# Altium project CollisionDetection.PrjPcb
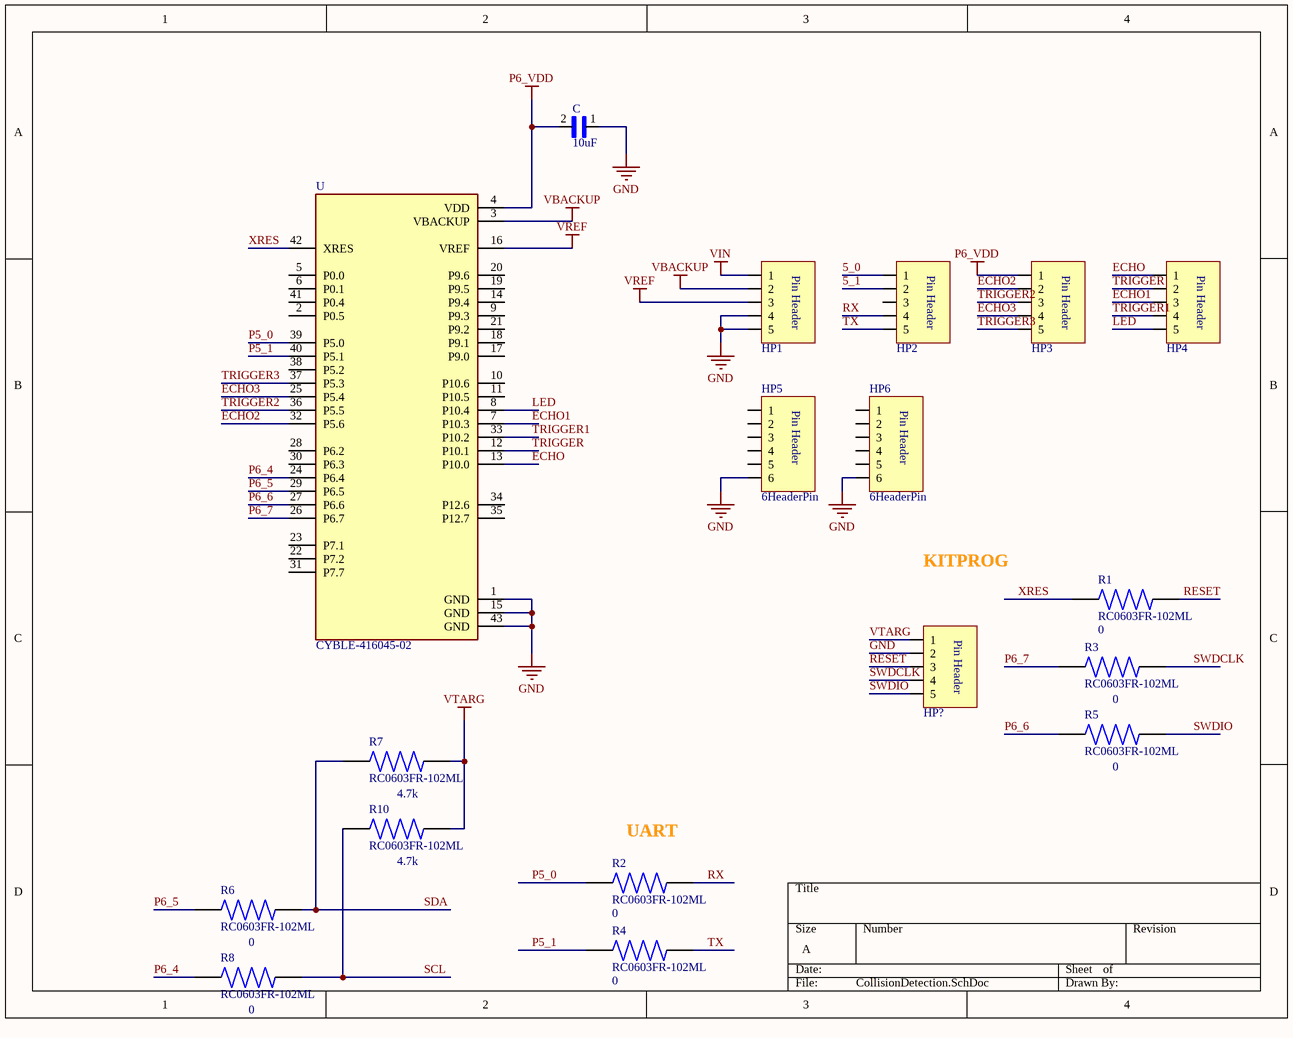
[diagram p0: CollisionDetection.SchDoc]
1 sheet, 18 parts. Net scope: global (net labels, ports and power ports of the same name join across sheets).
Board file: CollisionDetection.PcbDoc

## Sheet CollisionDetection.SchDoc
size A; SheetNumber: 1; SheetTotal: 1

### Parts
C  10uF  [CAPC1608X90]
HP1  5HeaderPin  [5HeaderPin]  (value not drawn)
HP2  5HeaderPin  [5HeaderPin]  (value not drawn)
HP3  5HeaderPin  [5HeaderPin]  (value not drawn)
HP4  5HeaderPin  [5HeaderPin]  (value not drawn)
HP5  6HeaderPin  [6HeaderPin]
HP6  6HeaderPin  [6HeaderPin]
HP?  5HeaderPin  [5HeaderPin]  (value not drawn)
R1  RC0603FR-102ML  value 0  [RESC1608X55N]
R2  RC0603FR-102ML  value 0  [RESC1608X55N]
R3  RC0603FR-102ML  value 0  [RESC1608X55N]
R4  RC0603FR-102ML  value 0  [RESC1608X55N]
R5  RC0603FR-102ML  value 0  [RESC1608X55N]
R6  RC0603FR-102ML  value 0  [RESC1608X55N]
R7  RC0603FR-102ML  value 4.7k  [RESC1608X55N]
R8  RC0603FR-102ML  value 0  [RESC1608X55N]
R10  RC0603FR-102ML  value 4.7k  [RESC1608X55N]
U  CYBLE-416045-02  [XCVR_CYBLE-416045-02]

### Nets
GND: C.1 HP1.4 HP1.5 HP5.6 HP6.6 HP?.2 U.1(GND) U.15(GND) U.43(GND)
P6_VDD: C.2 HP3.1 U.4(VDD)
VBACKUP: HP1.2 U.3(VBACKUP)
VIN: HP1.1
VREF: HP1.3 U.16(VREF)
VTARG: HP?.1 R7.2 R10.2
5_0: HP2.1
5_1: HP2.2
ECHO: HP4.1 U.13(P10.0)
ECHO1: HP4.3 U.7(P10.3)
ECHO2: HP3.2 U.32(P5.6)
ECHO3: HP3.4 U.25(P5.4)
LED: HP4.5 U.8(P10.4)
P5_0: R2.1 U.39(P5.0)
P5_1: R4.1 U.40(P5.1)
P6_4: R8.1 U.24(P6.4)
P6_5: R6.1 U.29(P6.5)
P6_6: R5.1 U.27(P6.6)
P6_7: R3.1 U.26(P6.7)
RESET: HP?.3 R1.2
RX: HP2.4 R2.2
SCL: R8.2 R10.1
SDA: R6.2 R7.1
SWDCLK: HP?.4 R3.2
SWDIO: HP?.5 R5.2
TRIGGER: HP4.2 U.12(P10.1)
TRIGGER1: HP4.4 U.33(P10.2)
TRIGGER2: HP3.3 U.36(P5.5)
TRIGGER3: HP3.5 U.37(P5.3)
TX: HP2.5 R4.2
XRES: R1.1 U.42(XRES)

Not connected (* = marked no-connect by the designer): HP2 3; HP5 1 2 3 4 5; HP6 1 2 3 4 5; U 2(P0.5) 5(P0.0) 6(P0.1) 9(P9.3) 10(P10.6) 11(P10.5) 14(P9.4) 17(P9.0) 18(P9.1) 19(P9.5) 20(P9.6) 21(P9.2) 22(P7.2) 23(P7.1) 28(P6.2) 30(P6.3) 31(P7.7) 34(P12.6) 35(P12.7) 38(P5.2) 41(P0.4)

### Notes on the sheet
- KITPROG
- (near R2) UART
- (in symbol 5HeaderPin) Pin Header
- (in symbol 6HeaderPin) Pin Header

### Library data of the parts
C = C0603C104K3RACTU: 0.1ÂµF Â±10% 25V Ceramic Capacitor X7R 0603 _1608 Metric_; MF: KEMET; Digi-Key_Part_Number: 399-1281-1-ND; SnapEDA_Link: https://www.snapeda.com/parts/C0603C104K3RACTU/KEMET/view-part/78674/?ref=snap; Package: 0603 Kemet; MP: C0603C104K3RACTU; Digi-Key_Purchase_URL: https://www.digikey.com/product-detail/en/kemet/C0603C104K3RACTU/399-1281-1-ND/416057?utm_source=snapeda&utm_medium=aggregator&utm_campaign=symbol; Value: *
U = CYBLE-416045-02: Bluetooth Bluetooth v5.0 Transceiver Module 2.4GHz ~ 2.5GHz Integrated, Trace Surface Mount; MF: Cypress Semiconductor; SnapEDA_Link: https://www.snapeda.com/parts/CYBLE-416045-02/Teledyne%20e2v/view-part/3593961/?ref=snap; Availability: Unavailable; MP: CYBLE-416045-02; Price: None; Value: *; Package: SMD-43 Cypress Semiconductor
R1-R8 R10 = RC0603FR-102ML: Package: None; Price: None; MP: RC0603FR-102ML; Availability: Unavailable